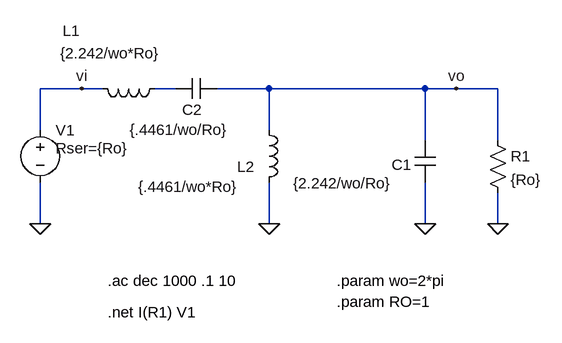
[diagram p0: schematic bp_butter_RL20dB.asc]
bp_butter_RL20dB.asc, the LTspice schematic file:
Version 4
SHEET 1 880 1328
WIRE -32 464 -96 464
WIRE 0 464 -32 464
WIRE 112 464 80 464
WIRE 256 464 176 464
WIRE 496 464 256 464
WIRE 544 464 496 464
WIRE 608 464 544 464
WIRE -96 528 -96 464
WIRE 256 528 256 464
WIRE 496 544 496 464
WIRE 608 544 608 464
WIRE -96 672 -96 608
WIRE 256 672 256 608
WIRE 496 672 496 608
WIRE 608 672 608 624
FLAG -96 672 0
FLAG -32 464 vi
FLAG 544 464 vo
FLAG 256 672 0
FLAG 608 672 0
FLAG 496 672 0
SYMBOL voltage -96 512 R0
WINDOW 3 24 96 Invisible 2
WINDOW 39 24 44 Left 2
SYMATTR Value 0
SYMATTR InstName V1
SYMATTR Value2 AC 1 0
SYMATTR SpiceLine Rser={Ro}
SYMBOL ind 96 448 R90
WINDOW 0 -57 144 VBottom 2
WINDOW 3 -54 84 VTop 2
SYMATTR InstName L1
SYMATTR Value {2.242/wo*Ro}
SYMATTR SpiceLine Rser=0
SYMBOL ind 240 512 R0
WINDOW 0 -33 72 Left 2
WINDOW 3 -185 103 Left 2
SYMATTR InstName L2
SYMATTR Value {.4461/wo*Ro}
SYMATTR SpiceLine Rser=0
SYMBOL res 592 528 R0
SYMATTR InstName R1
SYMATTR Value {Ro}
SYMBOL cap 176 448 R90
WINDOW 0 64 38 VBottom 2
WINDOW 3 64 58 VTop 2
SYMATTR InstName C2
SYMATTR Value {.4461/wo/Ro}
SYMATTR SpiceLine Rser=0
SYMBOL cap 480 544 R0
WINDOW 0 -35 37 Left 2
WINDOW 3 -187 66 Left 2
SYMATTR InstName C1
SYMATTR Value {2.242/wo/Ro}
SYMATTR SpiceLine Rser=0
TEXT 8 760 Left 2 !.ac dec 1000 .1 10
TEXT 360 760 Left 2 !.param wo=2*pi
TEXT 360 792 Left 2 !.param RO=1
TEXT 8 808 Left 2 !.net I(R1) V1

The netlist it stands for:
* bp_butter_RL20dB.asc
V1 vi 0 0 AC 1 0 Rser={Ro}
L1 N001 vi {2.242/wo*Ro} Rser=0
L2 vo 0 {.4461/wo*Ro} Rser=0
R1 vo 0 {Ro}
C2 vo N001 {.4461/wo/Ro} Rser=0
C1 vo 0 {2.242/wo/Ro} Rser=0
.ac dec 1000 .1 10
.param wo=2*pi
.param RO=1
.net I(R1) V1
.backanno
.end